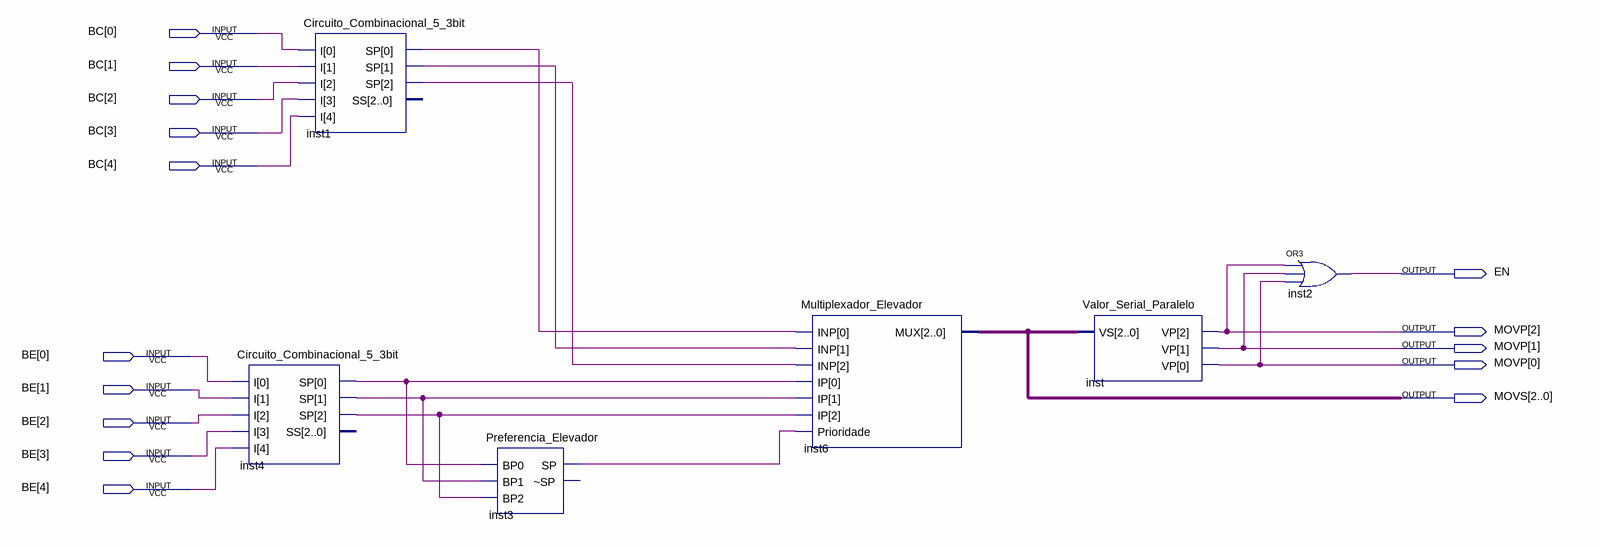
[diagram p0: schematic sheet]
// Quartus schematic Controlador_Prioridade.bdf as structural Verilog: 6 symbols, 15 pins
module Controlador_Prioridade (
  input  [4:0] BC,
  input  [4:0] BE,
  output EN,
  output [2:0] MOVP,
  output [2:0] MOVS
);

  wire inst1_sp, inst1_sp_2, inst1_sp_3, inst3_sp, inst4_sp, inst4_sp_2, inst4_sp_3;

  Circuito_Combinacional_5_3bit inst4 (.I(BE), .SP({inst4_sp_3, inst4_sp_2, inst4_sp}));  // open: SS
  Circuito_Combinacional_5_3bit inst1 (.I(BC), .SP({inst1_sp_3, inst1_sp_2, inst1_sp}));  // open: SS
  Preferencia_Elevador inst3 (.BP0(inst4_sp), .BP1(inst4_sp_2), .BP2(inst4_sp_3), .SP(inst3_sp));  // open: ~SP
  Multiplexador_Elevador inst6 (
    .INP({inst1_sp_3, inst1_sp_2, inst1_sp}), .IP({inst4_sp_3, inst4_sp_2, inst4_sp}), .Prioridade(inst3_sp),
    .MUX(MOVS));
  Valor_Serial_Paralelo inst (.VS(MOVS), .VP(MOVP));
  or inst2 (EN, MOVP[2], MOVP[1], MOVP[0]);
endmodule
